# EAGLE design ice_header_adapter_pcb (EAGLE 8.0.0)
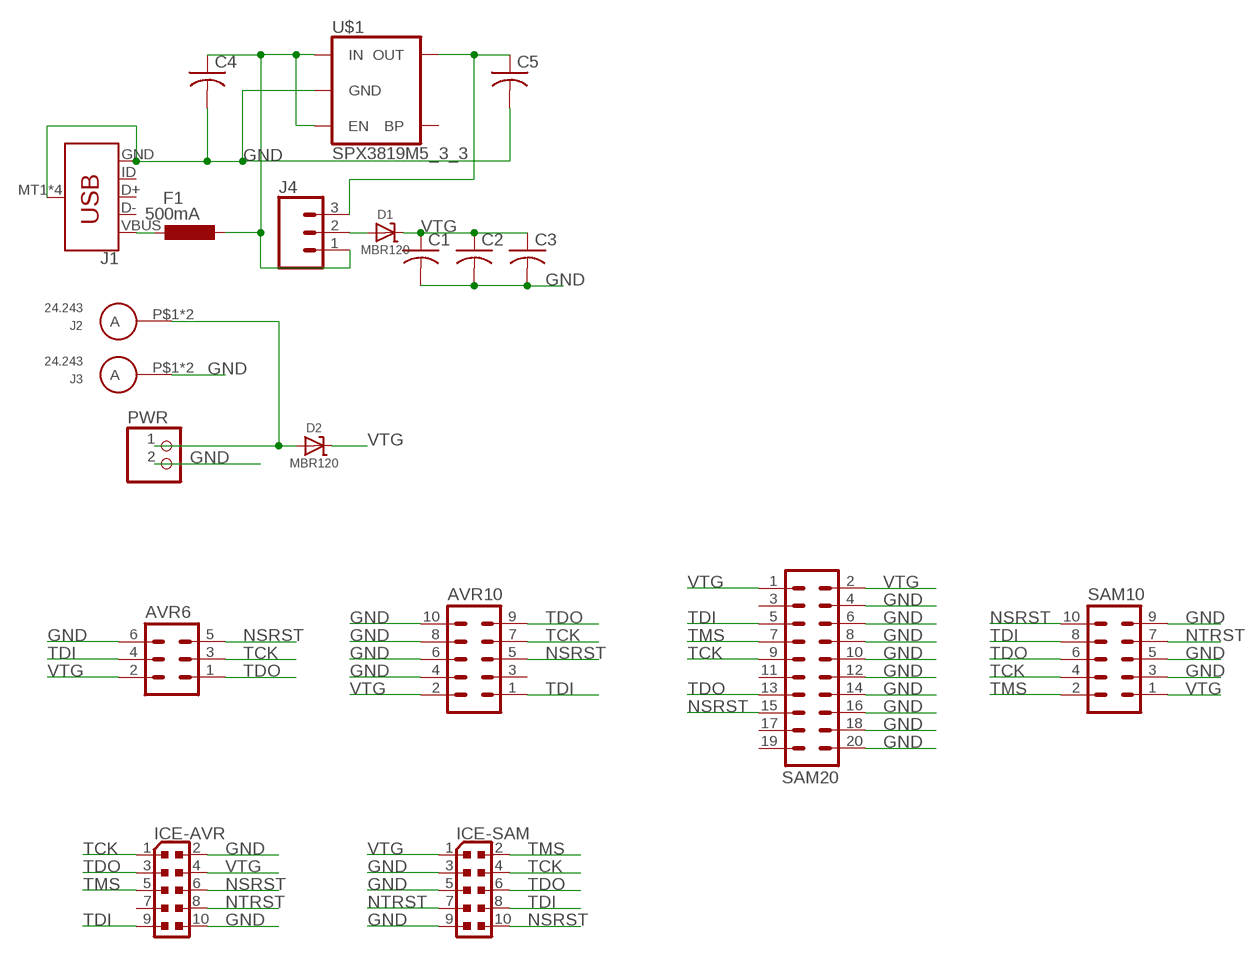
[diagram p0: schematic, sheet 1]

## Parts
AVR6  ML6  [ML6]
AVR10  ML10  [ML10]
C1  C-USC0603  [C0603]
C2  C-USC0603  [C0603]
C3  C-USC0603  [C0603]
C4  C-USC0603  [C0603]
C5  C-USC0603  [C0603]
D1  MBR120  DIODE-SCHOTTKYSOD-123  [SOD-123]
D2  MBR120  DIODE-SCHOTTKYSOD-123  [SOD-123]
F1  500mA  L-EUL1812  [L1812]
ICE-AVR  PINHEAD_PINHD-2X5PASSO127  [PINHEAD_2X05_127]
ICE-SAM  PINHEAD_PINHD-2X5PASSO127  [PINHEAD_2X05_127]
J1  USB_MICRO-B_SMT  [USB-MICROB]
J2  24.243  [24.243]
J3  24.243  [24.243]
J4  CONN_03LOCK  [1X03_LOCK]
PWR  PINHD-1X2/90  [1X02/90]
SAM10  ML10  [ML10]
SAM20  ML20  [ML20]
U$1  SPX3819M5_3_3  V_REG_SPX3819-SOT23-5  [SOT23-5]

## Nets
GND [pwr]: AVR6.6 AVR10.4 AVR10.6 AVR10.8 AVR10.10 C1.2 C2.2 C3.2 C4.2 C5.2 ICE-AVR.2 ICE-AVR.10 ICE-SAM.3 ICE-SAM.5 ICE-SAM.9 J1.GND J1.MT1(SHIELD) J1.MT2(SHIELD) J1.P$1(SHIELD) J1.P$2(SHIELD) J3.P$1(A) J3.P$2(A) PWR.2 SAM10.3 SAM10.5 SAM10.9 SAM20.4 SAM20.6 SAM20.8 SAM20.10 SAM20.12 SAM20.14 SAM20.16 SAM20.18 SAM20.20 U$1.2(GND)
N$1: D2.A J2.P$1(A) J2.P$2(A) PWR.1
N$2: C4.1 F1.1 J4.1 U$1.1(IN) U$1.3(EN)
N$3: D1.A J4.2
N$4: F1.2 J1.VBUS
N$6: C5.1 J4.3 U$1.5(OUT)
NSRST: AVR6.5 AVR10.5 ICE-AVR.6 ICE-SAM.10 SAM10.10 SAM20.15
NTRST: ICE-AVR.8 ICE-SAM.7 SAM10.7
TCK: AVR6.3 AVR10.7 ICE-AVR.1 ICE-SAM.4 SAM10.4 SAM20.9
TDI: AVR6.4 AVR10.1 ICE-AVR.9 ICE-SAM.8 SAM10.8 SAM20.5
TDO: AVR6.1 AVR10.9 ICE-AVR.3 ICE-SAM.6 SAM10.6 SAM20.13
TMS: ICE-AVR.5 ICE-SAM.2 SAM10.2 SAM20.7
VTG [pwr]: AVR6.2 AVR10.2 C1.1 C2.1 C3.1 D1.C D2.C ICE-AVR.4 ICE-SAM.1 SAM10.1 SAM20.1 SAM20.2
Unconnected: AVR10.3 ICE-AVR.7 J1.D+ J1.D- J1.ID SAM20.3 SAM20.11 SAM20.17 SAM20.19 U$1.4(BP)

## Library data of the parts
AVR6 = con-harting-ml:ML6: HARTING; OC_FARNELL: unknown; OC_NEWARK: unknown
AVR10 SAM10 = con-harting-ml:ML10: HARTING; OC_FARNELL: unknown; OC_NEWARK: unknown
C1-C5 = adafruit:C-US: CAPACITOR, American symbol
D1 D2 = microbuilder:DIODE-SCHOTTKY
F1 = rcl:L-EU: INDUCTOR, European symbol
ICE-AVR ICE-SAM = Arduino_Wifi_shield_v018_tG:PINHEAD_PINHD-2X5: PIN HEADER
J1 = SparkFun-Connectors:USB_MICRO-B: USB Type Micro-B Connector Male/female and PTH/SMT variants SparkFun Products: SparkFun microB USB Breakout <https://www.sparkfun.com/products/12035> SparkFun USB microB Plug Breakout <https://www.sparkfun.com/products/10031> SparkFun ESP8266 Thing <https://www.sparkfun.com/products/13231>; PROD_ID: CONN-09505; SF_ID: PRT-08533
J2 J3 = JacoBurge:24.243
J4 = SparkFun-Connectors:CONN_03: Multi connection point. Often used as Generic Header-pin footprint for 0.1 inch spaced/style header connections On any of the 0.1 inch spaced packages, you can populate with these: Break Away Headers - Straight <https://www.sparkfun.com/products/116> (PRT-00116) Break Away Male Headers - Right Angle <https://www.sparkfun.com/products/553> (PRT-00553) Female Headers <https://www.sparkfun.com/products/115> (PRT-00115) Break Away Headers - Machine Pin <https://www.sparkfun.com/products/117> (PRT-00117) Break Away Female Headers - Swiss Machine Pin <https://www.sparkfun.com/products/743> (PRT-00743) Stackable Header - 3 Pin (Female, 0.1") <https://www.sparkfun.com/products/13875> (PRT-13875) For SCREWTERMINALS and SPRING TERMINALS visit here: Screw Terimnals on SparkFun.com <https://www.sparkfun.com/search/results?term=Screw+Terminals> (5mm/3.5mm/2.54mm spacing) This device is also useful as a general connection point to wire up your design to another part of your project. Our various solder wires solder well into these plated through hole pads. Hook-Up Wire - Assortment (Stranded, 22 AWG) <https://www.sparkfun.com/products/11375> (PRT-11375) Hook-Up Wire - Assortment (Solid Core, 22 AWG) <https://www.sparkfun.com/products/11367> (PRT-11367) View the entire wire category on our website here <https://www.sparkfun.com/categories/141> Special notes: Molex polarized connector foot print use with SKU : PRT-08232 with associated crimp pins and housings.
PWR = pinhead:PINHD-1X2: PIN HEADER
SAM20 = con-harting-ml:ML20: HARTING; OC_FARNELL: unknown; OC_NEWARK: unknown
U$1 = SparkFun-IC-Power:V_REG_SPX3819: SPX3819 Voltage Regulator 3.3V 500mA, 16V input Datasheet <https://www.exar.com/content/document.ashx?id=22106> SparkFun Products: SparkFun Serial Controlled Motor Driver <https://www.sparkfun.com/products/13911>; PROD_ID: VREG-13321

## Net classes
1 pwr: width 0.5 mm, drill 0.5 mm, clearance 0.3 mm

## Board
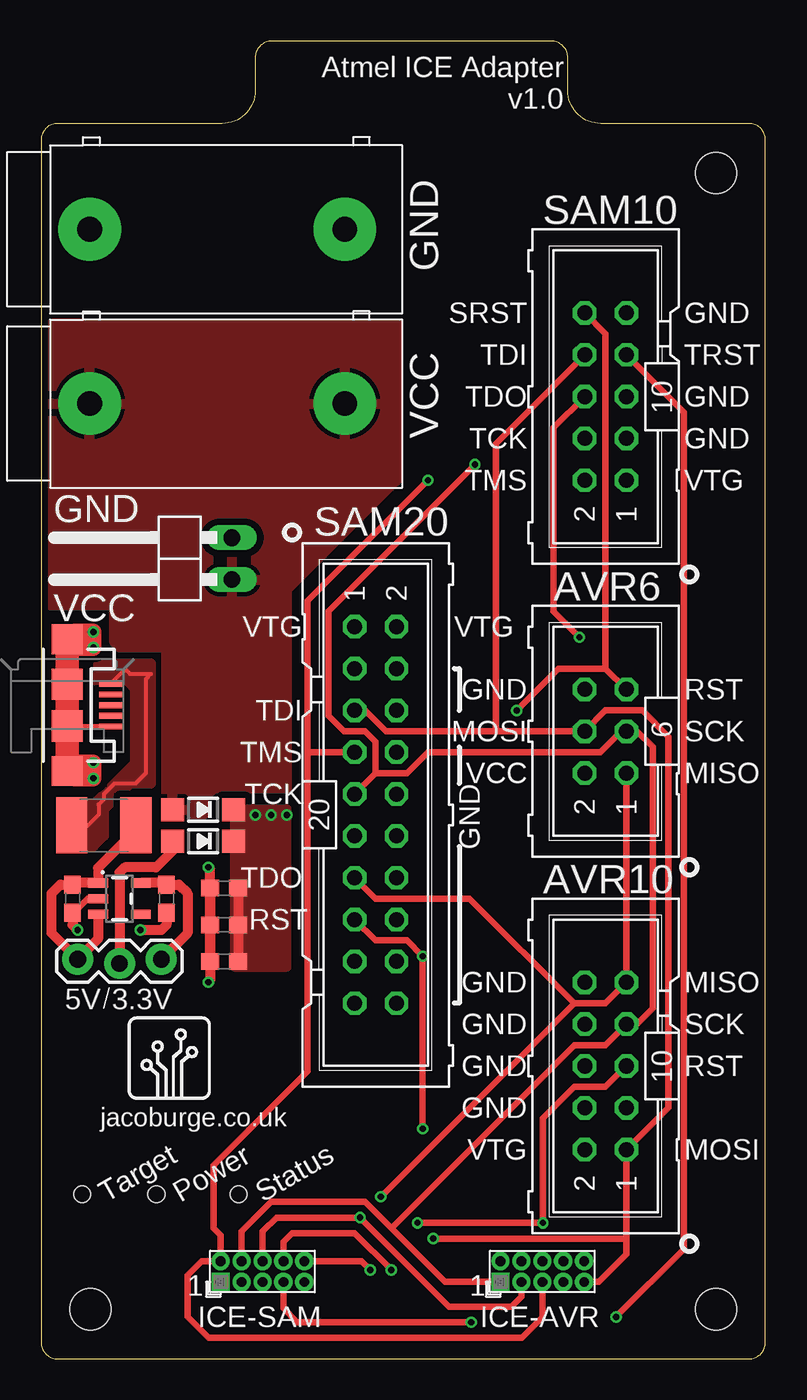
[diagram p1: board, top side]
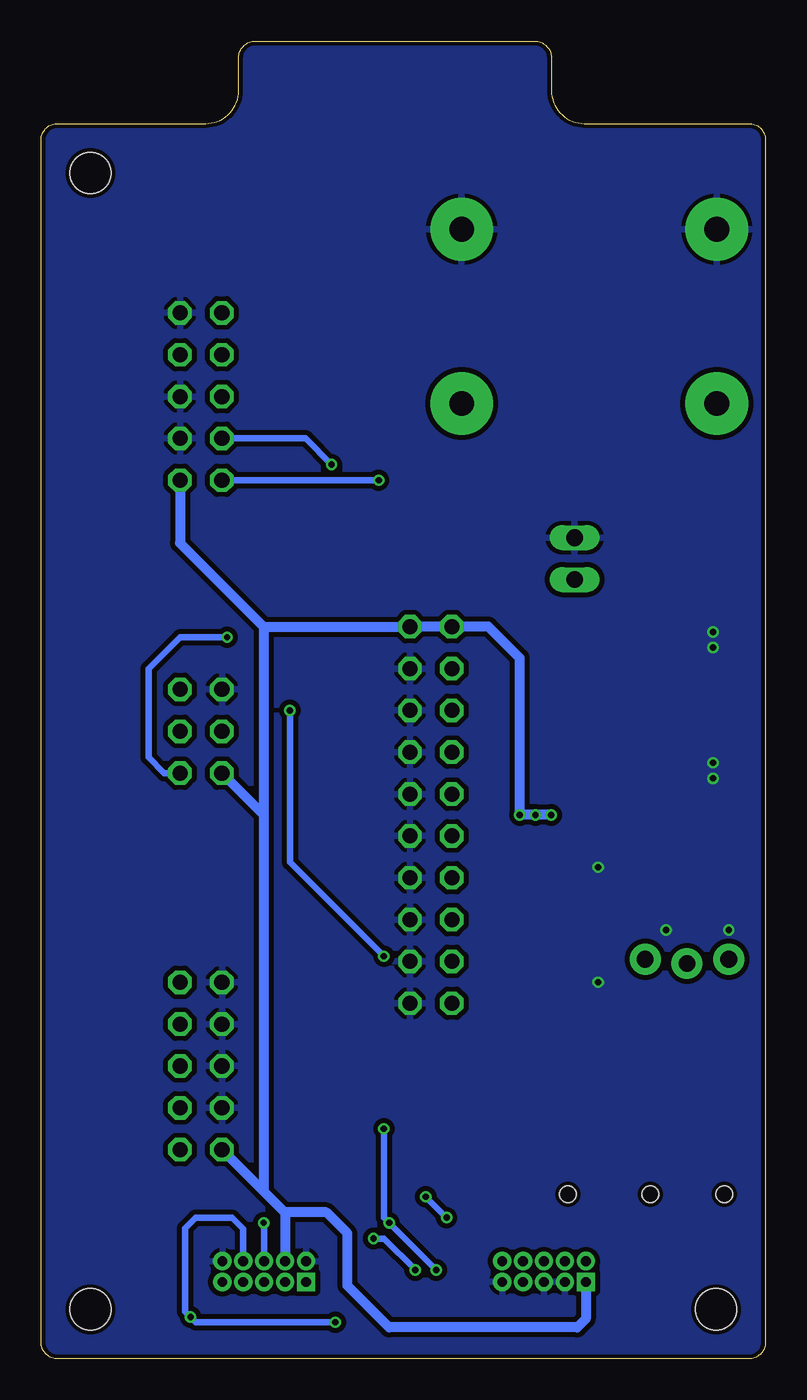
[diagram p2: board, bottom side, seen from below]

Size 44 x 80 mm. Coordinates in mm from the lower left corner, seen from the top.
Outline: 0,74 0,1 arc90 1,0 43,0 arc90 44,1 44,74 arc90 43,75 34,75 arc-90 32,77 32,79 arc90 31,80 14,80 arc90 13,79 13,77 arc-90 11,75 1,75 arc90 0,74
Copper layers (1*16): Top 0.035mm / dielectric 1.5mm / Bottom 0.035mm
Design rules "dirtCheap": minimum track width 5mil, minimum drill 12mil, track to track 5mil, track to pad 5mil, pad to pad 5mil, via to via 5mil, smd to smd 0mil, copper to edge 10mil, drill to drill 10mil, minimum pad ring 10mil, minimum via ring 6mil, stop-mask expansion 2mil, vias tented up to drill 25mil, thermal gap 10mil
Holes 2.5 mm at 41,72 41,3 3,3
Holes 1 mm at 2.5,10 7,10 12,10

### Footprints (pad centres in the part's own frame; a part is rotated, then mirrored left to right if it is on the bottom)
ML6 = drill 0.914 octagon: 1 -2.54,-1.27; 2 -2.54,1.27; 3 0,-1.27; 4 0,1.27; 5 2.54,-1.27; 6 2.54,1.27
ML10 = drill 0.914 octagon: 1 -5.08,-1.27; 2 -5.08,1.27; 3 -2.54,-1.27; 4 -2.54,1.27; 5 0,-1.27; 6 0,1.27; 7 2.54,-1.27; 8 2.54,1.27; 9 5.08,-1.27; 10 5.08,1.27
C0603 = smd 1.1 x 1: 1 -0.85,0; 2 0.85,0
SOD-123 = smd 1.4 x 1.4: A 1.85,0; C -1.85,0
L1812 = smd 1.9 x 3.4: 1 -1.95,0; 2 1.95,0
PINHEAD_2X05_127 = drill 0.6 pad 1.016 square: 1 -0.635,2.54 | drill 0.6 pad 1.016: 2 0.635,2.54; 3 -0.635,1.27; 4 0.635,1.27; 5 -0.635,0; 6 0.635,0; 7 -0.635,-1.27; 8 0.635,-1.27; 9 -0.635,-2.54; 10 0.635,-2.54
USB-MICROB = smd 1.4 x 0.35: D+ -2.65,0; D- -2.65,-0.65; GND -2.65,1.3; ID -2.65,0.65; VBUS -2.65,-1.3 | smd 1.9 x 1.8: MT1 0,-4; MT2 0,4 | smd 1.9 x 1.9: P$1 0,-1.27; P$2 0,1.27
24.243 = drill 1.5 pad 3.81: P$1 0,0.6; P$2 0,16.1
1X03_LOCK = drill 1.016 pad 1.88: 1 0,0.127; 2 2.54,-0.127; 3 5.08,0.127
1X02/90 = drill 1.016 long: 1 -1.27,-3.81; 2 1.27,-3.81
ML20 = drill 0.914 octagon: 1 -11.43,-1.27; 2 -11.43,1.27; 3 -8.89,-1.27; 4 -8.89,1.27; 5 -6.35,-1.27; 6 -6.35,1.27; 7 -3.81,-1.27; 8 -3.81,1.27; 9 -1.27,-1.27; 10 -1.27,1.27; 11 1.27,-1.27; 12 1.27,1.27; 13 3.81,-1.27; 14 3.81,1.27; 15 6.35,-1.27; 16 6.35,1.27; 17 8.89,-1.27; 18 8.89,1.27; 19 11.43,-1.27; 20 11.43,1.27
SOT23-5 = smd 0.55 x 1.2: 1 -0.95,-1.3; 2 0,-1.3; 3 0.95,-1.3; 4 0.95,1.3; 5 -0.95,1.3

### Placement (x,y rotation side)
AVR6  34.29,38.1 90 top
AVR10  34.29,17.78 90 top
C1  11.11,28.57 180 top
C2  11.11,26.35 180 top
C3  11.11,24.13 180 top
C4  1.91,27.94 270 top
C5  7.62,27.94 270 top
D1  9.84,31.43 180 top
D2  9.84,33.34 180 top
F1  3.81,32.38 180 top
ICE-AVR  30.45,5.3 90 top
ICE-SAM  13.45,5.3 90 top
J1  1.59,39.69 180 top
J2  19.05,58 90 top
J3  19.05,68.58 90 top
J4  2.22,24.13 0 top
PWR  7.78,48.59 90 top
SAM10  34.29,58.42 90 top
SAM20  20.32,33.02 270 top
U$1  4.76,27.94 270 top

### Tracks (layer width: path | path; a pad name or v marks a point on that pad's centre or on a via)
GND  (via drill 0.38)
  Top 0.305: J1.GND 1.62,38.39 J1.P$2
  Top 0.406: U$1.2 2.82,27.94 1.97,27.09 C4.2
  Top 0.61: C1.2 C2.2 C3.2 | C5.2 7.62,26.35 7.3,26.04 v6.03,26.04 | C3.2 10.26,29.74 v10.16,29.84 | C3.2 10.26,22.96 v10.16,22.86 | C4.2 1.91,26.35 v2.22,26.04
  Top 1.016: J1.MT1 2.03,44.13 v3.17,44.13 v3.17,43.18 2.1,43.18 J1.MT1 | J1.MT2 2.1,36.2 v3.17,36.2 v3.17,35.24 2.03,35.24 J1.MT2
  Top 1.422: J1.MT1 J1.P$1 J1.P$2 J1.MT2
  pour Bottom: -0.64,-0.64 -0.64,80.64 45.09,80.64 44.45,-0.64
N$1
  pour Top (isolate 0.406): 0.64,62.87 21.59,62.87 21.59,53.34 14.92,46.67 14.92,34.61 10.48,34.61 9.84,33.97 9.84,33.02 7.62,33.02 7.62,43.18 4.76,43.18 4.45,43.5 4.45,45.72 0.64,45.72
N$2
  Top 0.61: 5.44,31.5 F1.1 5.71,32.07 3.46,29.82 U$1.1 2,28.89 C4.1 1.17,28.79 0.64,28.26 0.64,25.84 J4.1 3.46,25.5 U$1.3
N$3
  Top 0.61: D1.A 7.99,30.85 6.99,29.84 5.08,29.84 4.76,29.53 J4.2
N$4
  Top 0.254: J1.VBUS 5.08,41.83 5.08,41.91 5.4,41.59 6.67,41.59 6.35,41.27 6.35,35.56 5.71,34.92 4.45,34.92 3.81,34.29 3.81,33.97 3.49,33.66 3.49,33.02 2.86,32.38 F1.2
  pour Top (isolate 0.406, no thermals): 3.49,42.23 6.67,42.23 6.67,34.92 5.4,34.92 3.81,33.34 3.81,31.75 3.17,31.11 1.27,31.11 1.27,33.66 2.54,33.66 3.17,33.66 4.76,35.24 5.71,36.2 5.71,40.64 5.4,40.96 3.49,40.96 3.49,41.91
N$6
  Top 0.61: U$1.5 7.84,28.89 C5.1 8.36,28.79 8.89,28.26 8.89,25.84 J4.3
NSRST  (via drill 0.38)
  Top 0.406: v22.86,8.26 v30.48,8.26 30.48,14.61 32.38,16.51 34.29,16.51 AVR10.5 | v20,5.4 19.46,5.93 ICE-SAM.10 | SAM20.15 20.32,25.4 22.23,25.4 v23.18,24.45 v23.18,13.97 | 34.29,41.91 AVR6.5 | 34.29,41.91 31.43,41.91 v28.89,39.37 | SAM10.10 34.29,62.23 34.29,41.91
  Bottom 0.406: ICE-AVR.6 30.45,8.22 v30.48,8.26 | v20,5.4 v22.86,8.26 23.18,8.57 v23.18,13.97 | v28.89,39.37 28.89,30.16 v23.18,24.45
NTRST  (via drill 0.38)
  Top 0.406: ICE-SAM.7 14.72,3.06 15.56,2.22 v26.13,2.22 | v34.92,2.54 39.05,6.67 39.05,57.47 SAM10.7
  Bottom 0.406: ICE-AVR.8 31.72,7.91 32.38,8.57 34.61,8.57 35.24,7.94 35.24,2.86 v34.92,2.54 34.61,2.22 v26.13,2.22
TCK  (via drill 0.38)
  Top 0.406: ICE-AVR.1 24.55,4.67 21.27,7.94 | 21.27,7.94 19.68,9.53 13.97,9.53 12.18,7.74 ICE-SAM.4 | 21.27,7.94 32.38,19.05 34.29,19.05 AVR10.7 36.2,20.32 37.15,21.27 37.15,37.15 36.2,38.1 AVR6.3 35.24,38.1 33.97,36.83 23.5,36.83 22.23,35.56 20.32,35.56 | 20.32,35.56 SAM20.9 | 20.32,35.56 20.32,37.47 19.68,38.1 18.41,38.1 17.46,39.05 17.46,45.4 v26.35,54.29
  Bottom 0.406: v26.35,54.29 27.94,55.88 SAM10.4
TDI  (via drill 0.38)
  Top 0.406: 35.56,7.3 AVR10.1 38.1,15.24 38.1,37.78 36.51,39.37 34.29,39.37 AVR6.4 27.62,38.1 | 35.56,7.3 35.56,6.35 33.88,4.67 ICE-AVR.9 | ICE-SAM.8 14.72,7.1 15.24,7.62 19.05,7.62 v21.27,5.4 | v23.81,7.3 35.56,7.3 | SAM20.5 19.68,39.37 20.95,38.1 27.62,38.1 | 27.62,38.1 27.62,55.56 SAM10.8
  Bottom 0.406: v21.27,5.4 23.18,7.3 v23.81,7.3
TDO  (via drill 0.38)
  Top 0.406: AVR6.1 AVR10.9 34.29,21.59 32.38,21.59 | 29.21,4.63 ICE-AVR.3 29.18,3.78 28.57,3.17 24.77,3.17 v19.37,8.57 14.29,8.57 13.45,7.74 ICE-SAM.6 | 32.38,21.59 v20.64,9.84 | 32.38,21.59 26.04,27.94 20.32,27.94 SAM20.13 | SAM10.6 31.11,56.52 31.11,45.4 v32.7,43.81
  Bottom 0.406: v32.7,43.81 35.56,43.81 37.47,41.91 37.47,36.51 36.51,35.56 AVR6.1 | v19.37,8.57 v20.64,9.84 v19.37,8.57
TMS  (via drill 0.38)
  Top 0.406: ICE-AVR.5 30.45,2.51 29.21,1.27 10.16,1.27 8.89,2.54 8.89,5.08 9.74,5.93 ICE-SAM.2 10.91,7.5 10.48,7.94 10.48,11.75 16.19,17.46 16.19,36.83 | SAM20.7 16.19,36.83 | v23.5,53.34 16.19,46.04 16.19,36.83
  Bottom 0.406: v23.5,53.34 SAM10.2
VTG  (via drill 0.38)
  Top 0.61: C1.1 C2.1 C3.1
  Bottom 0.61: 30.48,10.16 29.18,8.86 | 30.48,10.16 AVR10.2 | 29.18,8.86 ICE-AVR.4 | ICE-SAM.1 10.91,2.42 11.43,1.91 22.86,1.91 25.4,4.45 25.4,7.62 26.67,8.89 29.15,8.89 29.18,8.86 | 30.48,33.02 AVR6.2 | 30.48,33.02 30.48,10.16 | SAM10.1 35.56,49.53 30.48,44.45 | 30.48,44.45 SAM20.2 SAM20.1 16.83,44.45 14.92,42.55 v14.92,33.02 v13.02,33.02 | 30.48,44.45 30.48,33.02
  other vias: 13.97,33.02
  pour Top (no thermals): 11.75,23.81 14.92,23.81 14.92,33.34 11.75,33.34

### Text on the board
tPlace: GND | VCC
tNames: Atmel ICE Adapter / v1.0 | SRST | GND | TDI | TRST | TDO | GND | TCK | GND | TMS | VTG | GND | VCC | VTG | VTG | GND | TDI | RST | MOSI | TMS | SCK | VCC | TCK | GND | MISO | TDO | RST | GND | MISO | 5V | 3.3V | GND | SCK | GND | RST | GND | jacoburge.co.uk | VTG | MOSI | Target | Power | Status | 1 | 1 | ICE-SAM | ICE-AVR